# Altium schematic sheet Fuel_Gauge.SchDoc
size A4
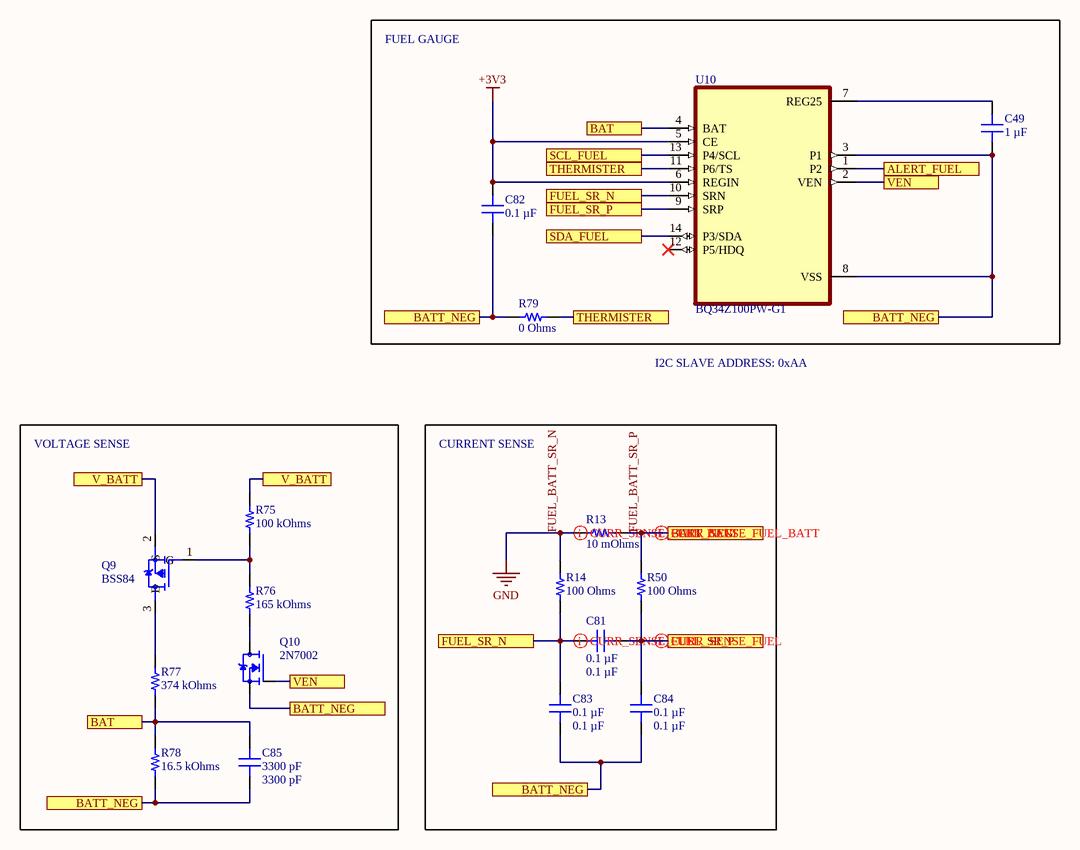
[diagram p0: Fuel_Gauge.SchDoc]

## Parts
C49  1 µF  [CAP 0402_1005]
C81  0.1 µF  [CAP 0603_1608]
C82  0.1 µF  [CAP 0402_1005]
C83  0.1 µF  [CAP 0603_1608]
C84  0.1 µF  [CAP 0603_1608]
C85  3300 pF  [CAP 0402_1005]
Q9  BSS84  [SOT95P240X120-3N]
Q10  2N7002  [SOT95P240X111-3N]
R13  10 mOhms  [RES 1210_3225]
R14  100 Ohms  [RES 0603_1608]
R50  100 Ohms  [RES 0603_1608]
R75  100 kOhms  [RES 0402_1005]
R76  165 kOhms  [RES 0402_1005]
R77  374 kOhms  [RES 0402_1005]
R78  16.5 kOhms  [RES 0603_1608]
R79  0 Ohms  [RES 0805_2012]
U10  BQ34Z100PW-G1  [SOP65P640X120-14N]

## Blocks framed on the sheet
FUEL GAUGE: C49 C82 R79 U10
VOLTAGE SENSE: C85 Q9 Q10 R75-R78
CURRENT SENSE: C81 C83 C84 R13 R14 R50

## Ports
ALERT_FUEL, BAT, BATT_NEG, FUEL_SR_N, FUEL_SR_P, SCL_FUEL, SDA_FUEL, THERMISTER, V_BATT, VEN

## Nets
+3V3: C82.2 U10.5(CE) U10.6(REGIN)
FUEL_BATT_SR_N: R13.1 R14.2  [also labelled GND]
ALERT_FUEL: U10.1(P2) ; port ALERT_FUEL
BAT: C85.2 R77.1 R78.2 U10.4(BAT) ; port BAT
FUEL_BATT_SR_P: C49.1 C82.1 C83.1 C84.1 C85.1 Q10.2(S) R13.2 R50.2 R78.1 R79.1 U10.3(P1) U10.8(VSS) ; port BATT_NEG
FUEL_SR_N: C81.2 C83.2 R14.1 U10.10(SRN) ; port FUEL_SR_N
FUEL_SR_P: C81.1 C84.2 R50.1 U10.9(SRP) ; port FUEL_SR_P
SCL_FUEL: U10.13(P4/SCL) ; port SCL_FUEL
SDA_FUEL: U10.14(P3/SDA) ; port SDA_FUEL
THERMISTER: R79.2 U10.11(P6/TS) ; port THERMISTER
V_BATT: Q9.2(S) R75.2 ; port V_BATT
VEN: Q10.1(G) U10.2(VEN) ; port VEN
NetC49_2: C49.2 U10.7(REG25)
NetQ9_1: Q9.1(G) R75.1 R76.2
NetQ9_3: Q9.3(D) R77.2
NetQ10_3: Q10.3(D) R76.1

Not connected (* = marked no-connect by the designer): U10 12(P5/HDQ)*

## Layout directives
differential pair; differential pair class CURR_SENSE_FUEL_BATT: FUEL_BATT_SR_N, FUEL_BATT_SR_P
differential pair; differential pair class CURR_SENSE_FUEL: FUEL_SR_N, FUEL_SR_P

## Notes on the sheet
- I2C SLAVE ADDRESS: 0xAA

## Library data of the parts
C49 = LMK105BJ105KPLF: CAP CER 1UF 10V X5R 0402; manufacturer: Taiyo Yuden; Tolerance: ±10%; Part Number: LMK105BJ105KPLF; Value: 1 µF; Applications: SMPS Filtering; Capacitance: 1 µF; componentlink1description: Datasheet; componentlink1url: https://ds.yuden.co.jp/TYCOMPAS/ut/detail?pn=LMK105BJ105KPLF &u=M; componentlink2description: DigiKey Link; componentlink2url: https://www.digikey.com/en/products/detail/taiyo-yuden/LMK105BJ105KPLF/7403744; Device Package: 0402 (1005 Metric); lastupdated: 9/08/2022 12:01:16 PM; Lifecycle Status: Active; Minimum Order: 1; Mounting Type: Surface Mount, MLCC; Operating Temperature: -55°C ~ 85°C; Package / Case: 0402 (1005 Metric); packaging: TapeAndReel; partid: 2328; Part Status: Active; price: 0.02; series: M; Size / Dimension: 0.039" L x 0.020" W (1.00mm x 0.50mm); Supplier 1: DigiKey; Supplier Part Number 1: 587-6274-1-ND; Temperature Coefficient: X5R; Thickness (Max): 0.026" (0.65mm); Voltage - Rated: 10V
C81 C83 C84 = C0603C104K5RAC7411: CAP CER 0.1UF 50V X7R 0603; manufacturer: KEMET; Tolerance: ±10%; Part Number: C0603C104K5RAC7411; Value: 0.1 µF; Applications: Bypass, Decoupling; Capacitance: 0.1 µF; componentlink1description: Datasheet; componentlink1url: https://api.kemet.com/component-edge/download/datasheet/C0603C104K5RAC7411.pdf; componentlink2description: DigiKey Link; componentlink2url: https://www.digikey.com/en/products/detail/kemet/C0603C104K5RAC7411/3317013; Device Package: 0603 (1608 Metric); lastupdated: 11/07/2023 7:07:50 PM; Lifecycle Status: Active; Minimum Order: 1; Mounting Type: Surface Mount, MLCC; Operating Temperature: -55°C ~ 125°C; Package / Case: 0603 (1608 Metric); packaging: TapeAndReel; partid: 2233; Part Status: Active; price: 0.01; series: SMD Comm X7R; Size / Dimension: 0.063" L x 0.031" W (1.60mm x 0.80mm); Supplier 1: DigiKey; Supplier Part Number 1: 399-C0603C104K5RAC7411CT-ND; Temperature Coefficient: X7R; Thickness (Max): 0.035" (0.90mm); Voltage - Rated: 50V
C82 = LMK105BJ104MC-F: CAP CER 0.1UF 10V X5R 0402; manufacturer: Taiyo Yuden; Tolerance: ±20%; Part Number: LMK105BJ104MC-F; Value: 0.1 µF; Applications: SMPS Filtering; Capacitance: 0.1 µF; componentlink1description: Datasheet; componentlink1url: https://www.yuden.co.jp/productdata/catalog/mlcc01_e.pdf; componentlink2description: DigiKey Link; componentlink2url: https://www.digikey.com/en/products/detail/taiyo-yuden/LMK105BJ104MC-F/6035743; Device Package: 0402 (1005 Metric); lastupdated: 9/08/2022 12:01:16 PM; Lifecycle Status: Active; Minimum Order: 1; Mounting Type: Surface Mount, MLCC; Operating Temperature: -55°C ~ 85°C; Package / Case: 0402 (1005 Metric); packaging: TapeAndReel; partid: 2414; Part Status: Active; price: 0.03; series: M; Size / Dimension: 0.039" L x 0.020" W (1.00mm x 0.50mm); Supplier 1: DigiKey; Supplier Part Number 1: 587-4572-1-ND; Temperature Coefficient: X5R; Thickness (Max): 0.009" (0.22mm); Voltage - Rated: 10V
C85 = AC0402KRX7R7BB332: CAP CER 3300PF 16V X7R 0402; manufacturer: Yageo; Tolerance: ±10%; Part Number: AC0402KRX7R7BB332; Value: 3300 pF; Applications: Automotive; Capacitance: 3300 pF; componentlink1description: Datasheet; componentlink1url: http://www.yageo.com/documents/recent/UPY-AC_NP0X7R_16V-to-630V_12.pdf; componentlink2description: DigiKey Link; componentlink2url: https://www.digikey.com/en/products/detail/yageo/AC0402KRX7R7BB332/6643254; Device Package: 0402 (1005 Metric); lastupdated: 11/07/2023 7:03:47 PM; Lifecycle Status: Active; Minimum Order: 1; Mounting Type: Surface Mount, MLCC; Operating Temperature: -55°C ~ 125°C; Package / Case: 0402 (1005 Metric); packaging: TapeAndReel; partid: 1886; Part Status: Active; price: 0.01; Ratings: AEC-Q200; series: AC; Size / Dimension: 0.039" L x 0.020" W (1.00mm x 0.50mm); Supplier 1: DigiKey; Supplier Part Number 1: 311-3268-1-ND; Temperature Coefficient: X7R; Thickness (Max): 0.022" (0.55mm); Voltage - Rated: 16V
Q9 = BSS84: BSS84 Series 50 V 10 Ohms P-Ch Enhancement Mode Field Effect Transistor SOT-23-3; MF: {'manufacturer': u'ON Semiconductor'}; Package: None; Price: None; Value: *; MP: BSS84; Availability: Unavailable
Q10 = 2N7002: N-Channel 60V 280mA (Ta) 350mW (Ta) Surface Mount SOT-23-3 (TO-236); MF: {'manufacturer': u'NTE Electronics, Inc'}; Package: None; Price: None; Value: *; MP: 2N7002; Availability: Unavailable
R13 = RL1210FR-070R01L: RES 0.01 OHM 1% 1/2W 1210; Manufacturer: Yageo; Power (Watts): 0.5W, 1/2W; Temperature Coefficient: ±1500ppm/°C; Part Number: RL1210FR-070R01L; ComponentLink1Description: Datasheet; ComponentLink1URL: http://www.yageo.com/documents/recent/PYu-RL_Group_521_RoHS_L_2.pdf; ComponentLink2Description: DigiKey Link; ComponentLink2URL: https://www.digikey.com/en/products/detail/yageo/RL1210FR-070R01L/3886087; Composition: Thick Film; Device Package: 1210 (3225 Metric); Features: Automotive AEC-Q200, Current Sense, Moisture Resistant; Height - Seated (Max): 0.026" (0.65mm); LastUpdated: 12/07/2023 8:34:03 PM; Lifecycle Status: Active; Minimum Order: 1; Number of Terminations: 2; Operating Temperature: -55°C ~ 155°C; Package / Case: 1210 (3225 Metric); Packaging: TapeAndReel; Part Status: Active; Price: 0.11; Ratings: AEC-Q200; Resistance: 10 mOhms; Series: RL; Size / Dimension: 0.122" L x 0.102" W (3.10mm x 2.60mm); Supplier 1: DigiKey; Supplier Part Number 1: 311-0.01NACT-ND; Supplier Device Package: 1210; Tolerance: ±1%; Value: 10 mOhms
R14 R50 = ERA-3AEB101V: RES SMD 100 OHM 0.1% 1/10W 0603; Manufacturer: Panasonic Electronic Components; Power (Watts): 0.1W, 1/10W; Temperature Coefficient: ±25ppm/°C; Part Number: ERA-3AEB101V; Value: 100 Ohms; ComponentLink1Description: Datasheet; ComponentLink1URL: https://industrial.panasonic.com/cdbs/www-data/pdf/RDM0000/AOA0000C307.pdf; ComponentLink2Description: DigiKey Link; ComponentLink2URL: https://www.digikey.com/en/products/detail/panasonic-electronic-components/ERA-3AEB101V/1465830; Composition: Thin Film; Device Package: 0603 (1608 Metric); Features: Automotive AEC-Q200; Height - Seated (Max): 0.022" (0.55mm); LastUpdated: 11/07/2023 7:34:29 PM; Lifecycle Status: Active; Minimum Order: 1; Number of Terminations: 2; Operating Temperature: -55°C ~ 155°C; Package / Case: 0603 (1608 Metric); Packaging: TapeAndReel; PartId: 5523; Part Status: Active; Price: 0.03; Ratings: AEC-Q200; Resistance: 100 Ohms; Series: ERA-3A; Size / Dimension: 0.063" L x 0.031" W (1.60mm x 0.80mm); Supplier 1: DigiKey; Supplier Part Number 1: P100DBCT-ND; Supplier Device Package: 0603; Tolerance: ±0.1%
R75 = RP73PF1E100KBTD: RES 100K OHM 0.1% 1/10W 0402; Manufacturer: TE Connectivity Passive Product; Power (Watts): 0.1W, 1/10W; Temperature Coefficient: ±25ppm/°C; Part Number: RP73PF1E100KBTD; Value: 100 kOhms; ComponentLink1Description: Datasheet; ComponentLink1URL: https://www.te.com/commerce/DocumentDelivery/DDEController?Action=srchrtrv&DocNm=1773272&DocType=DS&DocLang=English; ComponentLink2Description: DigiKey Link; ComponentLink2URL: https://www.digikey.com/en/products/detail/te-connectivity-passive-product/RP73PF1E100KBTD/8261053; Composition: Thin Film; Device Package: 0402 (1005 Metric); Height - Seated (Max): 0.014" (0.35mm); LastUpdated: 12/07/2023 7:24:29 PM; Lifecycle Status: Active; Minimum Order: 1; Number of Terminations: 2; Operating Temperature: -55°C ~ 155°C; Package / Case: 0402 (1005 Metric); Packaging: TapeAndReel; PartId: 2436; Part Status: Active; Price: 0.08; Resistance: 100 kOhms; Series: RP73, Holsworthy; Size / Dimension: 0.039" L x 0.020" W (1.00mm x 0.50mm); Supplier 1: DigiKey; Supplier Part Number 1: A127511CT-ND; Supplier Device Package: 0402; Tolerance: ±0.1%
R76 = RP73PF1E165KBTD: RES 165K OHM 0.1% 1/10W 0402; Manufacturer: TE Connectivity Passive Product; Power (Watts): 0.1W, 1/10W; Temperature Coefficient: ±25ppm/°C; Part Number: RP73PF1E165KBTD; Value: 165 kOhms; ComponentLink1Description: Datasheet; ComponentLink1URL: https://www.te.com/commerce/DocumentDelivery/DDEController?Action=srchrtrv&DocNm=1773272&DocType=DS&DocLang=English; ComponentLink2Description: DigiKey Link; ComponentLink2URL: https://www.digikey.com/en/products/detail/te-connectivity-passive-product/RP73PF1E165KBTD/8261074; Composition: Thin Film; Device Package: 0402 (1005 Metric); Height - Seated (Max): 0.014" (0.35mm); LastUpdated: 12/07/2023 7:24:29 PM; Lifecycle Status: Active; Minimum Order: 1; Number of Terminations: 2; Operating Temperature: -55°C ~ 155°C; Package / Case: 0402 (1005 Metric); Packaging: TapeAndReel; PartId: 2420; Part Status: Active; Price: 0.08; Resistance: 165 kOhms; Series: RP73, Holsworthy; Size / Dimension: 0.039" L x 0.020" W (1.00mm x 0.50mm); Supplier 1: DigiKey; Supplier Part Number 1: A127532CT-ND; Supplier Device Package: 0402; Tolerance: ±0.1%
R77 = ERJ-2RKF3743X: RES SMD 374K OHM 1% 1/10W 0402; Manufacturer: Panasonic Electronic Components; Power (Watts): 0.1W, 1/10W; Temperature Coefficient: ±100ppm/°C; Part Number: ERJ-2RKF3743X; Value: 374 kOhms; ComponentLink1Description: Datasheet; ComponentLink1URL: https://industrial.panasonic.com/cdbs/www-data/pdf/RDA0000/AOA0000C304.pdf; ComponentLink2Description: DigiKey Link; ComponentLink2URL: https://www.digikey.com/en/products/detail/panasonic-electronic-components/ERJ-2RKF3743X/192327; Composition: Thick Film; Device Package: 0402 (1005 Metric); Features: Automotive AEC-Q200; Height - Seated (Max): 0.016" (0.40mm); LastUpdated: 12/07/2023 7:24:13 PM; Lifecycle Status: Active; Minimum Order: 1; Number of Terminations: 2; Operating Temperature: -55°C ~ 155°C; Package / Case: 0402 (1005 Metric); Packaging: CutTape; PartId: 6416; Part Status: Active; Price: 0.01; Ratings: AEC-Q200; Resistance: 374 kOhms; Series: ERJ-2RK; Size / Dimension: 0.039" L x 0.020" W (1.00mm x 0.50mm); Supplier 1: DigiKey; Supplier Part Number 1: P374KLCT-ND; Supplier Device Package: 0402; Tolerance: ±1%
R78 = 1-2176089-8: RES SMD 16.5K OHM 0.1% 1/6W 0603; Manufacturer: TE Connectivity Passive Product; Power (Watts): 0.167W, 1/6W; Temperature Coefficient: ±25ppm/°C; Part Number: 1-2176089-8; Value: 16.5 kOhms; ComponentLink1Description: Datasheet; ComponentLink1URL: https://www.te.com/commerce/DocumentDelivery/DDEController?Action=srchrtrv&DocNm=1773272&DocType=DS&DocLang=English; ComponentLink2Description: DigiKey Link; ComponentLink2URL: https://www.digikey.com/en/products/detail/te-connectivity-passive-product/1-2176089-8/4033693; Composition: Thin Film; Device Package: 0603 (1608 Metric); Height - Seated (Max): 0.022" (0.55mm); LastUpdated: 11/07/2023 7:34:02 PM; Lifecycle Status: Active; Minimum Order: 1; Number of Terminations: 2; Operating Temperature: -55°C ~ 155°C; Package / Case: 0603 (1608 Metric); Packaging: TapeAndReel; PartId: 11782; Part Status: Active; Price: 0.14; Resistance: 16.5 kOhms; Series: RP73P, Holsworthy; Size / Dimension: 0.061" L x 0.031" W (1.55mm x 0.80mm); Supplier 1: DigiKey; Supplier Part Number 1: A110225CT-ND; Supplier Device Package: 0603; Tolerance: ±0.1%
R79 = JR0805X35E: 0805 35 AMP JUMPER; Manufacturer: Ohmite; Power (Watts): 0.245W; Part Number: JR0805X35E; Value: 0 Ohms; ComponentLink1Description: Datasheet; ComponentLink1URL: https://www.ohmite.com/assets/docs/res_jr.pdf?r=false; ComponentLink2Description: DigiKey Link; ComponentLink2URL: https://www.digikey.com/en/products/detail/ohmite/JR0805X35E/10233372; Composition: Metal Element; Device Package: 0805 (2012 Metric); Height - Seated (Max): 0.022" (0.55mm); LastUpdated: 12/07/2023 7:52:18 PM; Lifecycle Status: Active; Minimum Order: 1; Number of Terminations: 2; Operating Temperature: -55°C ~ 150°C; Package / Case: 0805 (2012 Metric); Packaging: TapeAndReel; PartId: 29311; Part Status: Active; Price: 0.10; Resistance: 0 Ohms; Series: JR; Size / Dimension: 0.079" L x 0.049" W (2.00mm x 1.25mm); Supplier 1: DigiKey; Supplier Part Number 1: JR0805X35ECT-ND; Supplier Device Package: 0805; Tolerance: Jumper
U10 = BQ34Z100PW-G1: MF: {'manufacturer': u'Texas Instruments'}; Package: None; Price: None; Value: *; MP: BQ34Z100PW-G1; Availability: Unavailable